# Altium schematic sheet Codec.SchDoc
size A4; SheetNumber: 2; SheetTotal: 9
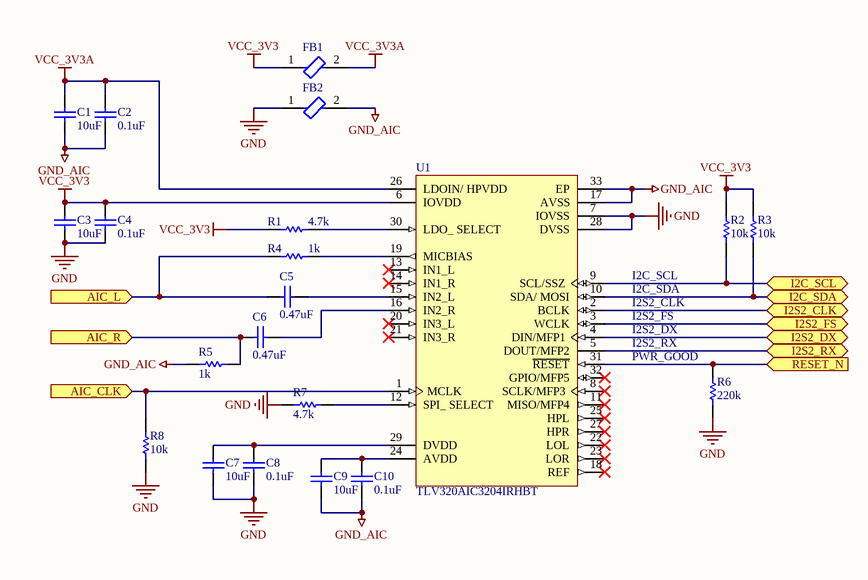
[diagram p0: Codec.SchDoc]

## Parts
C1  10uF  [0805_C_S]
C2  0.1uF  [0805_C_S]
C3  10uF  [0805_C_S]
C4  0.1uF  [0805_C_S]
C5  0.47uF  [0805_C_S]
C6  0.47uF  [0805_C_S]
C7  10uF  [0805_C_S]
C8  0.1uF  [0805_C_S]
C9  10uF  [0805_C_S]
C10  0.1uF  [0805_C_S]
FB1  BLM21AG151SN1D  [FP-BLM21-0_2-t0_85-e0_5-MFG]  (value not drawn)
FB2  BLM21AG151SN1D  [FP-BLM21-0_2-t0_85-e0_5-MFG]  (value not drawn)
R1  4.7k  [0805_R_S]
R2  10k  [0805_R_S]
R3  10k  [0805_R_S]
R4  1k  [0805_R_S]
R5  1k  [0805_R_S]
R6  220k  [0805_R_S]
R7  4.7k  [0805_R_S]
R8  10k  [0805_R_S]
U1  TLV320AIC3204IRHBT  [RHB0032E_V]

## Ports
AIC_CLK (in), AIC_L (in), AIC_R (in), I2C_SCL (bidir), I2C_SDA (bidir), I2S2_CLK (bidir), I2S2_DX (bidir), I2S2_FS (bidir), I2S2_RX (bidir), RESET_N (in)

## Nets
GND: C3.1 C4.1 C7.1 C8.1 FB2.1 R6.1 R7.1 R8.1 U1.7(IOVSS) U1.28(DVSS)
GND_AIC: C1.1 C2.1 C9.1 C10.1 FB2.2 R5.2 U1.17(AVSS) U1.33(EP)
VCC_3V3: C3.2 C4.2 FB1.1 R1.2 R2.2 R3.2 U1.6(IOVDD)
VCC_3V3A: C1.2 C2.2 FB1.2 U1.26(LDOIN/_HPVDD)
AIC_CLK: R8.2 U1.1(MCLK) ; port AIC_CLK
AIC_L: C5.2 R4.2 ; port AIC_L
AIC_R: C6.2 R5.1 ; port AIC_R
I2C_SCL: R2.1 U1.9(SCL/SSZ) ; port I2C_SCL
I2C_SDA: R3.1 U1.10(SDA/_MOSI) ; port I2C_SDA
I2S2_CLK: U1.2(BCLK) ; port I2S2_CLK
I2S2_DX: U1.4(DIN/MFP1) ; port I2S2_DX
I2S2_FS: U1.3(WCLK) ; port I2S2_FS
I2S2_RX: U1.5(DOUT/MFP2) ; port I2S2_RX
RESET_N: R6.2 U1.31(~{RESET}) ; port RESET_N
NetC5_1: C5.1 U1.15(IN2_L)
NetC6_1: C6.1 U1.16(IN2_R)
NetC7_2: C7.2 C8.2 U1.29(DVDD)
NetC9_2: C9.2 C10.2 U1.24(AVDD)
NetR1_1: R1.1 U1.30(LDO__SELECT)
NetR4_1: R4.1 U1.19(MICBIAS)
NetR7_2: R7.2 U1.12(SPI__SELECT)

Not connected (* = marked no-connect by the designer): U1 8(SCLK/MFP3)* 11(MISO/MFP4)* 13(IN1_L)* 14(IN1_R)* 18(REF)* 20(IN3_L)* 21(IN3_R)* 22(LOL)* 23(LOR)* 25(HPL)* 27(HPR)* 32(GPIO/MFP5)*

## Notes on the sheet
- I2C_SCL
- I2C_SDA
- I2S2_CLK
- I2S2_FS
- PWR_GOOD
- I2S2_DX
- I2S2_RX

## Library data of the parts
C1-C10 = Cap: Capacitor; Published: 8-Jun-2000; LatestRevisionDate: 17-Jul-2002; LatestRevisionNote: Re-released for DXP Platform.; Publisher: Altium Limited
  C1 C3 C7 C9: Value: 10uF
  C2 C4 C8 C10: Value: 0.1uF
  C5 C6: Value: 0.47uF
FB1 FB2 = CMP-0686-00717-3: Chip Ferrite Bead, 0805, 150Ω @ 100MHz, 0.09Ω, 25%, 1A; Number of Circuits: 1; Max Current Rating: 800mA; DC Resistance (DCR): 100mR; Shielding: Unshielded; DC Current: 200mA; Impedance: 150R; Contact Plating: Tin; Weight: 0.000194oz; Series: EMIFIL®, BLM21A; Core Material: Ferrite; Test Frequency: 100MHz; Case Code (Metric): 2012; Package Quantity: 4000; Lead Free: Lead Free; Max Operating Temperature: 125°C; Case Code (Imperial): 0805; Material: Ferrite; Min Operating Temperature: -55°C; Tolerance: 25%; Length: 2mm; DC Resistance-Max: 100mR; Width: 1.25mm; RoHS Compliant: Yes; Packaging: Tape and Reel; REACH SVHC: No SVHC; Depth: 1.45mm; Number of Pins: 2; Radiation Hardening: No; Current Rating: 800mA; Height: 0.85mm; Termination: SMD/SMT; Number of Lines: 1; Max DC Current: 200mA; Case/Package: 0805
R1-R8 = Res1: Resistor; Published: 8-Jun-2000; LatestRevisionDate: 17-Jul-2002; LatestRevisionNote: Re-released for DXP Platform.; Publisher: Altium Limited
  R1 R7: Value: 4.7k
  R2 R3 R8: Value: 10k
  R4 R5: Value: 1k
  R6: Value: 220k
U1 = CMP-0331-00080-2: Very Low-Power Stereo Audio CODEC with Power Tune? Technology, 2 ADCs and 2 DACs, 100 dB DAC SNR, -40 to 85 degC, 32-pin QFN (RHB), Green (RoHS & no Sb/Br); Manufacturer: Texas Instruments; Digital Audio Interfaces: L, R, I2S, TDM, DSP; Sampling Rate (Max) (kHz): 192; DAC SNR: 100; # DACs: 2; Battery Powered: TRUE; Additional Features: PowerTune (tm), Processing blocks for digital audio effects, LP Bypass, PLL, Digital Mic Support, LDO; Control Interface: SPI, I2C; PartNumber: TLV320AIC3204IRHBT; Mounting Technology: Surface Mount; DatasheetVersion: SLOS602A; ComponentLink1URL: http://www.ti.com/general/docs/lit/getliterature.tsp?genericPartNumber=TLV320AIC3204&fileType=pdf; PackageDescription: 32-Pin Plastic Quad Flat No-Lead, 5 x 5 mm Body, 0.5 mm Pitch, 3.45 x 3.45 mm Exposed Pad; PackageReference: RHB0032E; PackageVersion: revD, Jun-2011; ComponentLink1Description: Datasheet; Code_JEDEC: MO-220; # ADCs (typ): 2